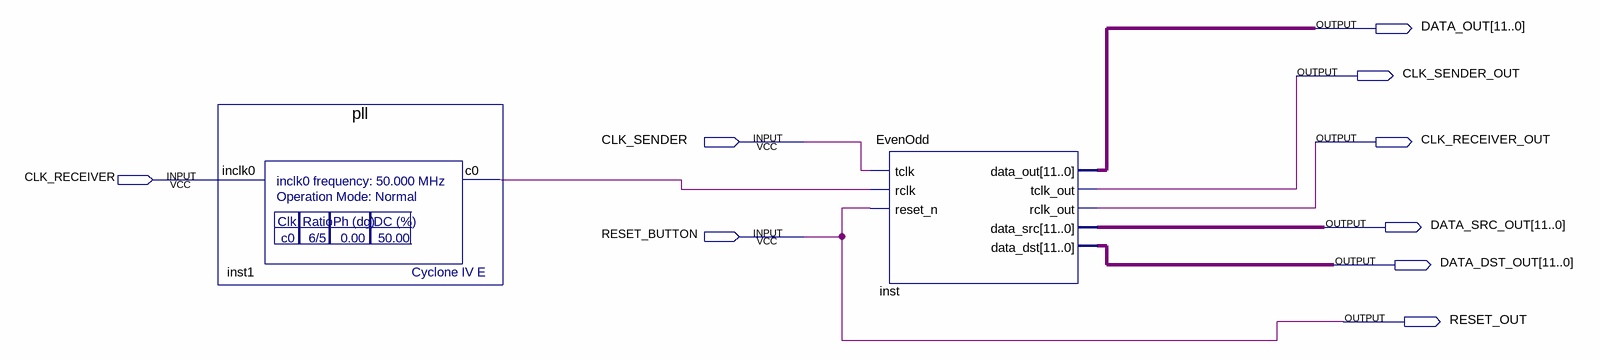
[diagram p0: schematic sheet]
// Quartus schematic EvenOdd_TOP.bdf as structural Verilog: 2 symbols, 9 pins
module EvenOdd_TOP (
  input  CLK_SENDER,
  input  CLK_RECEIVER,
  input  RESET_BUTTON,
  output [11:0] DATA_OUT,
  output CLK_SENDER_OUT,
  output CLK_RECEIVER_OUT,
  output [11:0] DATA_SRC_OUT,
  output [11:0] DATA_DST_OUT,
  output RESET_OUT
);

  wire inst1_c0;

  pll inst1 (.inclk0(CLK_RECEIVER), .c0(inst1_c0));
  EvenOdd inst (
    .tclk(CLK_SENDER), .rclk(inst1_c0), .reset_n(RESET_BUTTON), .data_out(DATA_OUT),
    .tclk_out(CLK_SENDER_OUT), .rclk_out(CLK_RECEIVER_OUT), .data_src(DATA_SRC_OUT), .data_dst(DATA_DST_OUT));

  assign RESET_OUT = RESET_BUTTON;
endmodule
